# Altium schematic sheet ATMEGA2560.SchDoc
size A4
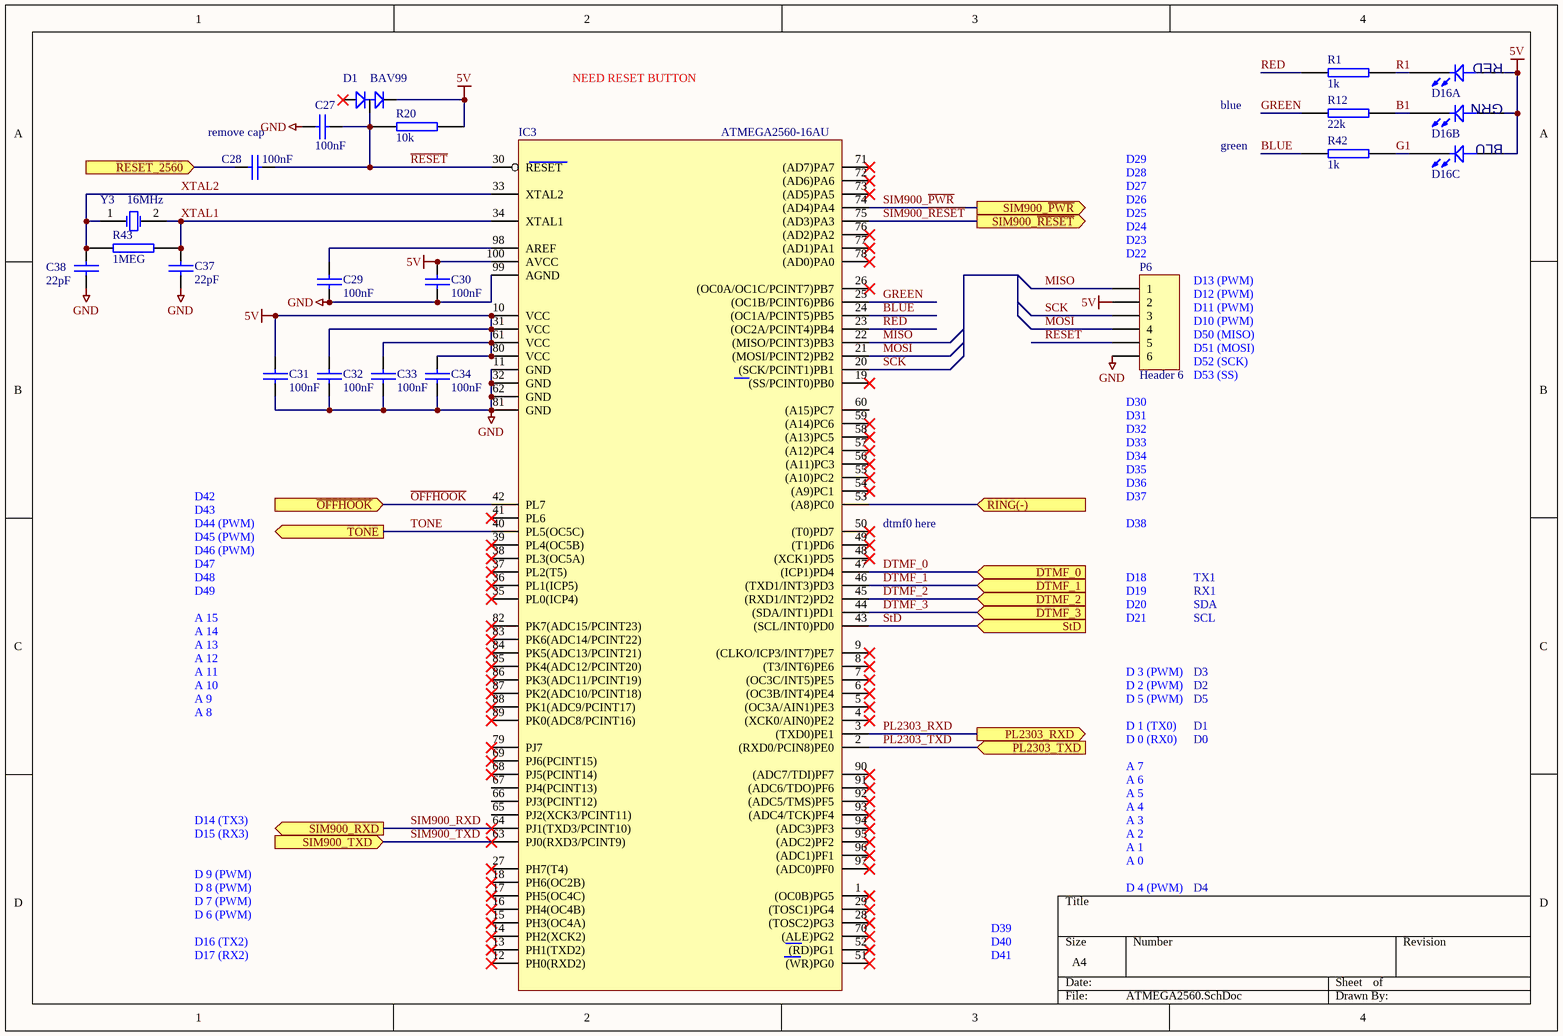
[diagram p0: ATMEGA2560.SchDoc]

## Parts
C27  100nF  [CAP (3D) - 0603]
C28  100nF  [CAP (3D) - 0603]
C29  100nF  [CAP (3D) - 0603]
C30  100nF  [CAP (3D) - 0603]
C31  100nF  [CAP (3D) - 0603]
C32  100nF  [CAP (3D) - 0603]
C33  100nF  [CAP (3D) - 0603]
C34  100nF  [CAP (3D) - 0603]
C37  22pF  [CAP (3D) - 0603]
C38  22pF  [CAP (3D) - 0603]
D1  BAV99  [SOT23-3L]
D16  RGB 5mm  [LED(3D) 5MM RIGHT ANGLE (RGB) - COMMON ANODE]  (value not drawn)  (parts A,B,C of 3)
IC3  ATMEGA2560-16AU  [TQFP100]
P6  Header 6  [HDR2X3 (3D)]  (no BOM)
R1  1k  [RES (3D) - 0603]
R12  22k  [RES (3D) - 0603]
R20  10k  [RES (3D) - 0603]
R42  1k  [RES (3D) - 0603]
R43  1MEG  [RES (3D) - 0603]
Y3  16MHz  [HC49/4H_SMX]

## Ports
DTMF_0 (in), DTMF_1 (in), DTMF_2 (in), DTMF_3 (in), PL2303_RXD (out), PL2303_TXD (in), RESET_2560 (in), RING(-) (in), SIM900_RXD (out), SIM900_TXD (in), SIM900_~{PWR} (out), SIM900_~{RESET} (out), StD (in), TONE (out), ~{OFFHOOK} (in)

## Nets
5V: C30.1 C31.1 C32.1 C33.1 C34.1 D1.2(C2) D16.2(A) IC3.10(VCC) IC3.31(VCC) IC3.61(VCC) IC3.80(VCC) IC3.100(AVCC) P6.2 R20.2
GND: C27.1 C29.2 C30.2 C31.2 C32.2 C33.2 C34.2 C37.2 C38.2 IC3.11(GND) IC3.32(GND) IC3.62(GND) IC3.81(GND) IC3.99(AGND) P6.6
B1: D16.4(K) R12.2
BLUE: IC3.24((OC1A/PCINT5)PB5) R42.1
DTMF_0: IC3.47((ICP1)PD4) ; port DTMF_0
DTMF_1: IC3.46((TXD1/INT3)PD3) ; port DTMF_1
DTMF_2: IC3.45((RXD1/INT2)PD2) ; port DTMF_2
DTMF_3: IC3.44((SDA/INT1)PD1) ; port DTMF_3
G1: D16.3(K) R42.2
GREEN: IC3.25((OC1B/PCINT6)PB6) R12.1
MISO: IC3.22((MISO/PCINT3)PB3) P6.1
MOSI: IC3.21((MOSI/PCINT2)PB2) P6.4
~{OFFHOOK}: IC3.42(PL7) ; port ~{OFFHOOK}
PL2303_RXD: IC3.3((TXD0)PE1) ; port PL2303_RXD
PL2303_TXD: IC3.2((RXD0/PCIN8)PE0) ; port PL2303_TXD
R1: D16.1(K) R1.2
~{RESET}: C27.2 C28.2 D1.3(C1/A2) IC3.30(RESET) P6.5 R20.1
RED: IC3.23((OC2A/PCINT4)PB4) R1.1
RESET_2560: C28.1 ; port RESET_2560
RING(-): IC3.53((A8)PC0) ; port RING(-)
SCK: IC3.20((SCK/PCINT1)PB1) P6.3
SIM900_~{PWR}: IC3.74((AD4)PA4) ; port SIM900_~{PWR}
SIM900_~{RESET}: IC3.75((AD3)PA3) ; port SIM900_~{RESET}
SIM900_RXD: IC3.64(PJ1(TXD3/PCINT10)) ; port SIM900_RXD
SIM900_TXD: IC3.63(PJ0(RXD3/PCINT9)) ; port SIM900_TXD
StD: IC3.43((SCL/INT0)PD0) ; port StD
TONE: IC3.40(PL5(OC5C)) ; port TONE
XTAL1: C37.1 IC3.34(XTAL1) R43.2 Y3.2(OSC2)
XTAL2: C38.1 IC3.33(XTAL2) R43.1 Y3.1(OSC1)
NetC29_1: C29.1 IC3.98(AREF)

Not connected (* = marked no-connect by the designer): D1 1(A1)*; IC3 1((OC0B)PG5)* 4((XCK0/AIN0)PE2)* 5((OC3A/AIN1)PE3)* 6((OC3B/INT4)PE4)* 7((OC3C/INT5)PE5)* 8((T3/INT6)PE6)* 9((CLKO/ICP3/INT7)PE7)* 12(PH0(RXD2))* 13(PH1(TXD2))* 14(PH2(XCK2))* 15(PH3(OC4A))* 16(PH4(OC4B))* 17(PH5(OC4C))* 18(PH6(OC2B))* 19((SS/PCINT0)PB0)* 26((OC0A/OC1C/PCINT7)PB7)* 27(PH7(T4))* 28((TOSC2)PG3)* 29((TOSC1)PG4)* 35(PL0(ICP4))* 36(PL1(ICP5))* 37(PL2(T5))* 38(PL3(OC5A))* 39(PL4(OC5B))* 41(PL6)* 48((XCK1)PD5)* 49((T1)PD6)* 50((T0)PD7)* 51((WR)PG0)* 52((RD)PG1)* 54((A9)PC1)* 55((A10)PC2)* 56((A11)PC3)* 57((A12)PC4)* 58((A13)PC5)* 59((A14)PC6)* 60((A15)PC7) 65(PJ2(XCK3/PCINT11)) 66(PJ3(PCINT12)) 67(PJ4(PCINT13)) 68(PJ5(PCINT14))* 69(PJ6(PCINT15))* 70((ALE)PG2)* 71((AD7)PA7)* 72((AD6)PA6)* 73((AD5)PA5)* 76((AD2)PA2)* 77((AD1)PA1)* 78((AD0)PA0)* 79(PJ7)* 82(PK7(ADC15/PCINT23))* 83(PK6(ADC14/PCINT22))* 84(PK5(ADC13/PCINT21))* 85(PK4(ADC12/PCINT20))* 86(PK3(ADC11/PCINT19))* 87(PK2(ADC10/PCINT18))* 88(PK1(ADC9/PCINT17))* 89(PK0(ADC8/PCINT16))* 90((ADC7/TDI)PF7)* 91((ADC6/TDO)PF6)* 92((ADC5/TMS)PF5)* 93((ADC4/TCK)PF4)* 94((ADC3)PF3)* 95((ADC2)PF2)* 96((ADC1)PF1)* 97((ADC0)PF0)*

## Notes on the sheet
- NEED RESET BUTTON
- blue
- (near C28) remove cap
- D29
- D28
- green
- (near P6) D23
- D24
- D25
- D26
- D27
- (near P6) D22
- D11 (PWM)
- D12 (PWM)
- D13 (PWM)
- D53 (SS)
- D52 (SCK)
- D51 (MOSI)
- D50 (MISO)
- D10 (PWM)
- (near P6) D30
- D31
- D32
- D33
- D42
- D43
- D37
- D36
- D35
- D34
- D47
- D48
- D44 (PWM)
- D45 (PWM)
- D46 (PWM)
- (near IC3) dtmf0 here
- D18
- D38
- TX1
- D49
- A 13
- A 14
- A 15
- D19
- D20
- D21
- RX1
- SDA
- SCL
- A 8
- A 9
- A 10
- A 11
- A 12
- D 5 (PWM)
- D 2 (PWM)
- D 3 (PWM)
- D5
- D3
- D2
- D 0 (RX0)
- D 1 (TX0)
- A 6
- A 7
- D0
- D1
- D15 (RX3)
- D14 (TX3)
- A 1
- A 2
- A 3
- A 4
- A 5
- D 6 (PWM)
- D 7 (PWM)
- D 8 (PWM)
- D 9 (PWM)
- D 4 (PWM)
- A 0
- D4
- D17 (RX2)
- D16 (TX2)
- D41
- D40
- D39
- (in symbol RGB_5mm, part A) RED
- (in symbol RGB_5mm, part B) GRN
- (in symbol RGB_5mm, part C) BLU

## Library data of the parts
C27-C34 = CAP SMD 0603 100nF: CAPACITOR SMD 0603; Manufacturer: Murata; Manufacturer Part No.: GCM188R71C104KA37D; Mouser Part no.: 81-GCM188R71C104KA7D; Web link: http://au.mouser.com/ProductDetail/Murata/GCM188R71C104KA37D/?qs=aEuGZpxfbxWKAxwYn%252beTMg%3d%3d; value: 100nF
C37 C38 = CAP SMD 0603 1nF: CAPACITOR SMD 0603; Manufacturer: Vishay; Manufacturer Part No.: VJ0603A220JXACW1BC; value: 22pF; Mouser Part no.: 77-VJ0603A220JXACBC; Web link: http://au.mouser.com/ProductDetail/Vishay-Vitramon/VJ0603A220JXACW1BC/?qs=sGAEpiMZZMv9Q1JI0Mo%2ftTD%2f4380kv7n
D1 = BAV99: DUAL DIODE, BAV99; Manufacturer: FAIRCHILD SEMICONDUCTOR; Mouser Part no.: 771-BAV99/T3; Manufacturer Part No.: BAV99; value: BAV99; Web link: http://au.mouser.com/ProductDetail/NXP-Semiconductors/BAV99-T3/?qs=sGAEpiMZZMtldOIVIVqa3WNg7zlWz8nBhXHsMX6ttIg%3d
D16 = RGB_5mm: value: RGB 5mm; Web link: eBay
IC3 = ATMEGA25602560-16AU: Manufacturer: Atmel; Manufacturer Part No.: ATmega2560-16AU; Mouser Part no.: 556-ATMEGA2560-16AU; value: ATmega2560-16AU; Web link: http://au.mouser.com/ProductDetail/Atmel/ATmega2560-16AU/?qs=sGAEpiMZZMvqv2n3s2xjsVIKSdqlAUq67FxyjUE6IyE%3d
P6 = Header 6: Header, 6-Pin
R1 R42 = RES SMD 0603 10k: RESISTOR SMD 0603; Manufacturer: Bourns; Manufacturer Part No.: CR0603-JW-102ELF; Mouser Part no.: 652-CR0603-JW-102ELF; Web link: http://au.mouser.com/ProductDetail/Bourns/CR0603-JW-102ELF/?qs=sGAEpiMZZMu61qfTUdNhG2nPoCjtvs%252bRXTOJv8O9Kbk%3d; value: 1k
R12 = RES SMD 0603 10k: RESISTOR SMD 0603; Manufacturer: Bourns; Manufacturer Part No.: CR0603-FX-4223ELF; Mouser Part no.: 652-CR0603FX-4223ELF; Web link: http://au.mouser.com/ProductDetail/Bourns/CR0603-FX-4223ELF/?qs=CCIlxZRRv7hqply3rAXy4hrq0%2fcMGkZy; value: 22k
R20 = RES SMD 0603 10k: RESISTOR SMD 0603 10k; Manufacturer: Bourns; Manufacturer Part No.: CR0603FX-1002ELF; Mouser Part no.: 652-CR0603FX-1002ELF; Web link: http://au.mouser.com/Search/Refine.aspx?Keyword=652-CR0603FX-1002ELF; value: 10k
R43 = RES SMD 0603 0R: RESISTOR SMD 0603 0R; Manufacturer: Bourns; Manufacturer Part No.: CR0603-FX-1004ELF; Value: 1MEG; Mouser Part no.: 652-CR0603FX-1004ELF; Web link: http://au.mouser.com/ProductDetail/Bourns/CR0603-FX-1004ELF/?qs=sGAEpiMZZMu61qfTUdNhG6LqqFhkr6pUwbJgorvoIQA%3d
Y3 = XTAL: Crystal Oscillator; Manufacturer: ECS; Manufacturer Part No.: ECS-160-20-5PX-TR; Mouser Part No.: 520-CSM1600-20-X; Value: 16MHz; Web link: http://au.mouser.com/ProductDetail/ECS/ECS-160-20-5PX-TR/?qs=sGAEpiMZZMsBj6bBr9Q9aQ6SZfIlWoiS4s1%252bSpYOVXo%3d